# EAGLE schematic c pubsub_lower_isolate 5V (EAGLE 9.4.2)
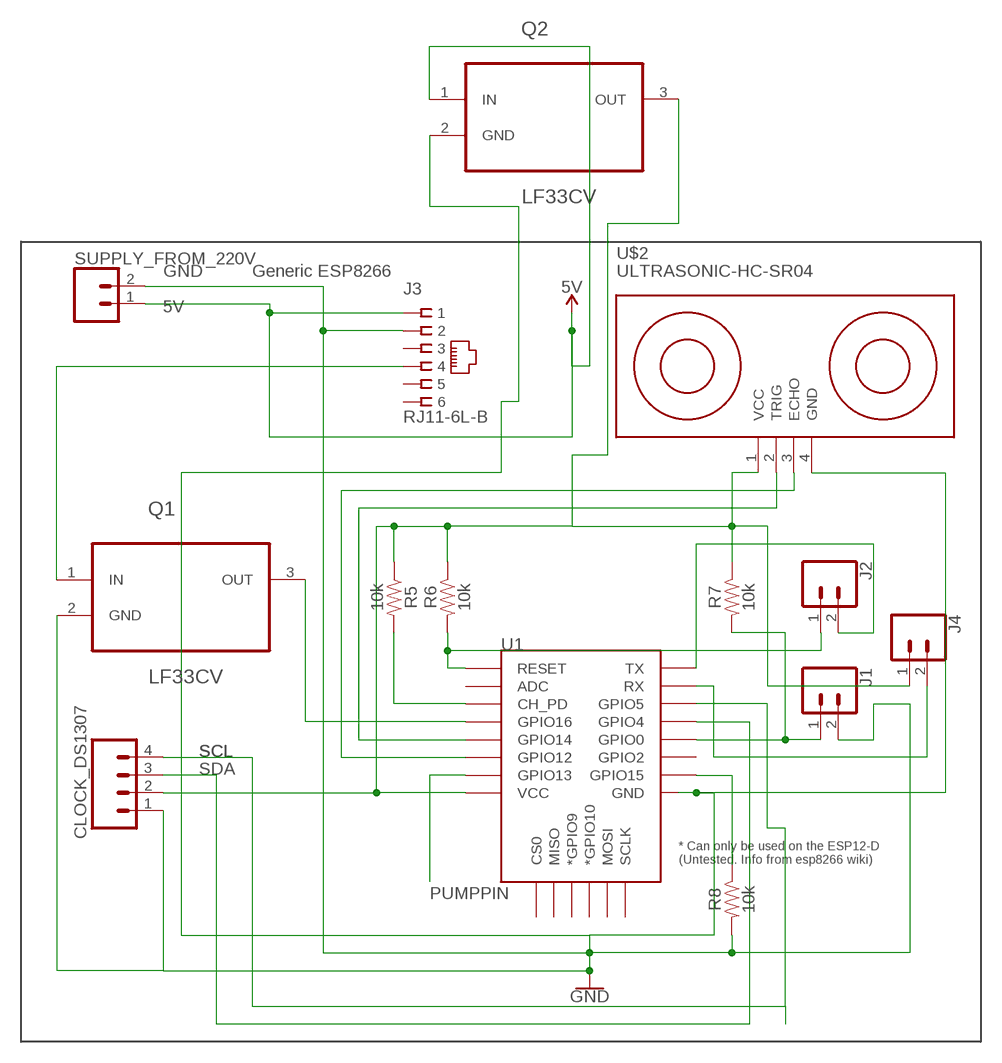
[diagram p0: schematic, sheet 1]

## Parts
CLOCK_DS1307  CONN_04PTH  [1X04]
J1  CONN_02  [1X02]
J2  CONN_02  [1X02]
J3  RJ11-6L-B  [RJ11-NO_SHIELD]
J4  CONN_02  [1X02]
Q1  LF33CV  [TO254P450X1020X1935-3P]
Q2  LF33CV  [TO254P450X1020X1935-3P]
R5  10k  10KOHM-HORIZ-1/4W-1%  [AXIAL-0.3]
R6  10k  10KOHM-HORIZ-1/4W-1%  [AXIAL-0.3]
R7  10k  10KOHM-HORIZ-1/4W-1%  [AXIAL-0.3]
R8  10k  10KOHM-HORIZ-1/4W-1%  [AXIAL-0.3]
SUPPLY_FROM_220V  CONN_02  [1X02]
U1  ESP12ESMD  [ESP12E-SMD]
U$2  ULTRASONIC-HC-SR04  [ULTRASONIC-HC-SR04]

## Nets
5V: J3.1 Q2.1(IN) SUPPLY_FROM_220V.1
GND: CLOCK_DS1307.1 J1.2 J3.2 Q1.2(GND) Q2.2(GND) R8.P$2 SUPPLY_FROM_220V.2 U1.GND U$2.4(GND)
N$1: R8.P$1 U1.GPIO15
N$2: J2.2 U1.TXD0(TX)
N$3: J2.1 R6.P$2 U1.RESET
N$4: R5.P$2 U1.CH_PD
N$6: J4.2 U1.RXD0(RX)
N$7: CLOCK_DS1307.2 J4.1 Q2.3(OUT) R5.P$1 R6.P$1 R7.P$1 U1.VCC U$2.1(VCC)
N$9: Q1.3(OUT) U1.GPIO16
N$11: J3.4 Q1.1(IN)
N$12: J1.1 R7.P$2 U1.GPIO0
N$13: U1.GPIO14 U$2.2(TRIG)
N$14: U1.GPIO12 U$2.3(ECHO)
PUMPPIN: U1.GPIO13
SCL: CLOCK_DS1307.4 U1.GPIO5
SDA: CLOCK_DS1307.3 U1.GPIO4
Unconnected: J3.3 J3.5 J3.6 U1.ADC U1.CS0 U1.GPIO2 U1.GPIO9(*GPIO9) U1.GPIO10(*GPIO10) U1.MISO U1.MOSI U1.SCLK

## Notes on the sheet
- Generic ESP8266

## Library data of the parts
CLOCK_DS1307 = SparkFun-Connectors:CONN_04: Multi connection point. Often used as Generic Header-pin footprint for 0.1 inch spaced/style header connections On any of the 0.1 inch spaced packages, you can populate with these: Break Away Headers - Straight <https://www.sparkfun.com/products/116> (PRT-00116) Break Away Male Headers - Right Angle <https://www.sparkfun.com/products/553> (PRT-00553) Female Headers <https://www.sparkfun.com/products/115> (PRT-00115) Break Away Headers - Machine Pin <https://www.sparkfun.com/products/117> (PRT-00117) Break Away Female Headers - Swiss Machine Pin <https://www.sparkfun.com/products/743> (PRT-00743) For SCREWTERMINALS and SPRING TERMINALS visit here: Screw Terimnals on SparkFun.com <https://www.sparkfun.com/search/results?term=Screw+Terminals> (5mm/3.5mm/2.54mm spacing) This device is also useful as a general connection point to wire up your design to another part of your project. Our various solder wires solder well into these plated through hole pads. Hook-Up Wire - Assortment (Stranded, 22 AWG) <https://www.sparkfun.com/products/11375> (PRT-11375) Hook-Up Wire - Assortment (Solid Core, 22 AWG) <https://www.sparkfun.com/products/11367> (PRT-11367) View the entire wire category on our website here <https://www.sparkfun.com/categories/141> Special notes: Molex polarized connector foot print use with SKU : PRT-08231 with associated crimp pins and housings. 1MM SMD Version SKU: PRT-10208; PROD_ID: CONN-09696
J1 J2 J4 SUPPLY_FROM_220V = SparkFun-Connectors:CONN_02: Multi connection point. Often used as Generic Header-pin footprint for 0.1 inch spaced/style header connections On any of the 0.1 inch spaced packages, you can populate with these: Break Away Headers - Straight <https://www.sparkfun.com/products/116> (PRT-00116) Break Away Male Headers - Right Angle <https://www.sparkfun.com/products/553> (PRT-00553) Female Headers <https://www.sparkfun.com/products/115> (PRT-00115) Break Away Headers - Machine Pin <https://www.sparkfun.com/products/117> (PRT-00117) Break Away Female Headers - Swiss Machine Pin <https://www.sparkfun.com/products/743> (PRT-00743) For SCREWTERMINALS and SPRING TERMINALS visit here: Screw Terimnals on SparkFun.com <https://www.sparkfun.com/search/results?term=Screw+Terminals> (5mm/3.5mm/2.54mm spacing) This device is also useful as a general connection point to wire up your design to another part of your project. Our various solder wires solder well into these plated through hole pads. Hook-Up Wire - Assortment (Stranded, 22 AWG) <https://www.sparkfun.com/products/11375> (PRT-11375) Hook-Up Wire - Assortment (Solid Core, 22 AWG) <https://www.sparkfun.com/products/11367> (PRT-11367) View the entire wire category on our website here <https://www.sparkfun.com/categories/141> Special notes: Molex polarized connector foot print use with: PRT-08233 with associated crimp pins and housings. 2.54_SCREWTERM for use with PRT-10571. 3.5mm Screw Terminal footprints for PRT-08084 5mm Screw Terminal footprints for use with PRT-08432
J3 = con-tycoelectronics:RJ11: CORCOM Modular RJ Jacks No Shield Source: www.tycoelectronics.com .. ENG_DS_1654001_1099_RJ_L_0507.pdf; MF: TYCO ELECTRONICS; MPN: RJ11-6L-B; OC_FARNELL: unknown; OC_NEWARK: 52K3613
Q1 Q2 = LF33CV:LF33CV: Very low drop voltage regulators with inhibit; DESCRIPTION: Linear Voltage Regulator IC 1 Output 500mA TO-220AB; DIGI-KEY_PART_NUMBER: 497-7313-5-ND; DIGI-KEY_PURCHASE_URL: https://www.digikey.pk/product-detail/en/stmicroelectronics/LF33CV/497-7313-5-ND/1038546?utm_source=snapeda&utm_medium=aggregator&utm_campaign=symbol; MF: STMicroelectronics; MP: LF33CV; PACKAGE: TO-220 STMicroelectronics
R5-R8 = SparkFun-Resistors:10KOHM: 10kΩ resistor A resistor is a passive two-terminal electrical component that implements electrical resistance as a circuit element. Resistors act to reduce current flow, and, at the same time, act to lower voltage levels within circuits. - Wikipedia; PROD_ID: RES-12183
U1 = esp8266modules:ESP12E: ESP12E Module
U$2 = diy-modules:ULTRASONIC-HC-SR04: Ultrasonic Ranging Module HC-SR04 More details available here: http://randomnerdtutorials.com/complete-guide-for-ultrasonic-sensor-hc-sr04/ Click here to find device on ebay.com <http://www.ebay.com/sch/hc+sr04+ultrasonic>